# Altium schematic sheet Dimmer.SchDoc
size A; SheetNumber: 6; SheetTotal: 8
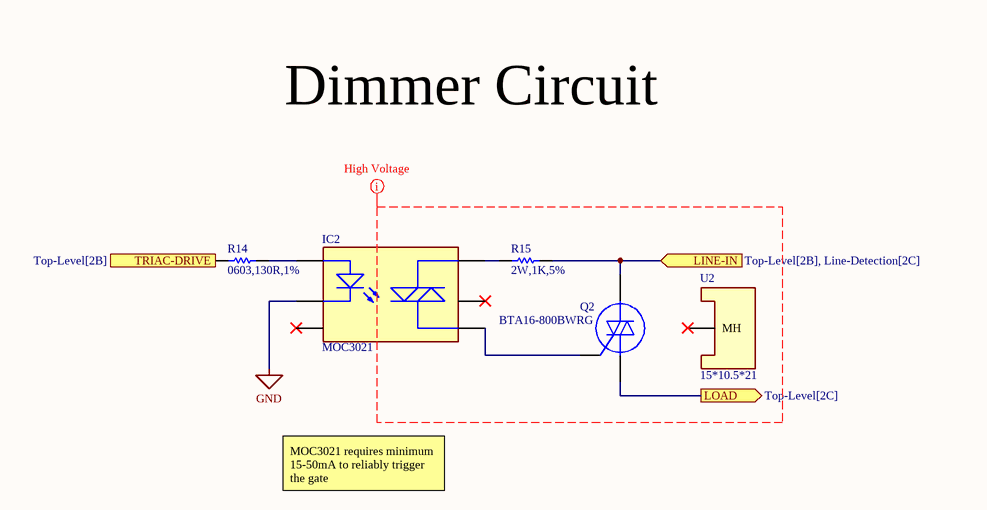
[diagram p0: Dimmer.SchDoc]

## Parts
IC2  MOC3021  [DIP-6_L8.5-W6.4-P2.54-LS7.6-BL]
Q2  BTA16-800BWRG  [TO255P1020X450X1965-3]
R14  0603,130R,1%  [RESC1608X55N]
R15  2W,1K,5%  [RES-TH_BD4.0-L11.5-P15.50-D0.7]
U2  15*10.5*21  [SINK-TH_L15.0-W10.5-H21.0]

## Ports
LINE-IN (in, see Top-Level[2B], Line-Detection[2C]), LOAD (out, see Top-Level[2C]), TRIAC-DRIVE (in, see Top-Level[2B])

## Nets
GND: IC2.2(CATHODE)
LINE-IN: Q2.2(A2) R15.2 ; port LINE-IN
LOAD: Q2.1(A1) ; port LOAD
TRIAC-DRIVE: R14.1 ; port TRIAC-DRIVE
NetIC2_1: IC2.1(ANODE) R14.2
NetIC2_4: IC2.4(MAIN_TERMINAL_1) Q2.3(G)
NetIC2_6: IC2.6(MAIN_TERMINAL_2) R15.1

Not connected (* = marked no-connect by the designer): IC2 3(NC)* 5(SUBSTRATE)*; U2 1(MH)*

## Layout directives
net class High-Voltage: (no net found under the mark)

## Notes on the sheet
- Dimmer Circuit
- MOC3021 requires minimum 15-50mA to reliably trigger the gate

## Library data of the parts
IC2 = MOC3021: 1000V/us 50mA 400V 1.15V TRIAC DIP-6 Triac, SCR Output Optoisolators ROHS; Manufacturer_Name: Lite-On; Manufacturer_Part_Number: MOC3020; Datasheet Link: https://www.arrow.com/en/products/moc3020/lite-on-technology?region=nac; Height: 4.5mm; Mouser Part Number: 859-MOC3020; Mouser Price/Stock: https://www.mouser.co.uk/ProductDetail/Lite-On/MOC3020?qs=kgKJAWzqwChc9Zw3a0r80A%3D%3D; Arrow Part Number: MOC3020; Arrow Price/Stock: null?region=nac; LCSC Part Number: C123202
Q2 = BTA16-800BWRG: 35mA 50mA 800V 1 TRIAC TO-220AB Thyristors (SCR)/Modules ROHS; Manufacturer_Name: STMicroelectronics; Datasheet Link: http://www.st.com/web/en/resource/technical/document/datasheet/CD00002265.pdf; Height: 4.6mm; Manufacturer_Part_Number: BTA16-800BWRG; Mouser Part Number: 511-BTA16-800BW; Mouser Price/Stock: https://www.mouser.co.uk/ProductDetail/STMicroelectronics/BTA16-800BWRG?qs=pt%2FMICWRfHvPicwiGmWB%252BA%3D%3D; Arrow Part Number: BTA16-800BWRG; Arrow Price/Stock: https://www.arrow.com/en/products/bta16-800bwrg/stmicroelectronics?utm_currency=USD&region=europe; LCSC Part Number: C10065
R14 = RC0603FR-07130RL: 130 Ohms ±1% 0.1W, 1/10W Chip Resistor 0603 (1608 Metric) Moisture Resistant Thick Film; Manufacturer_Name: YAGEO; Datasheet Link: https://www.mouser.com/catalog/specsheets/YAGEO_PYu_RC_Group_51_RoHS_L_12.pdf; Height: 0.55mm; Manufacturer_Part_Number: RC0603FR-07130RL; LCSC Part Number: C141677
R15 = FMP200JR-52-1K: Metal Film Resistor 1kΩ 2W ±5% Through Hole,D3.9xL9mm Through Hole Resistors ROHS; LCSC Part Number: C1740167
U2 = 15*10.5*21: 15.5*10.5*21MM 6063-T5 Heat sink / cooling fin ROHS; LCSC Part Number: C7421513